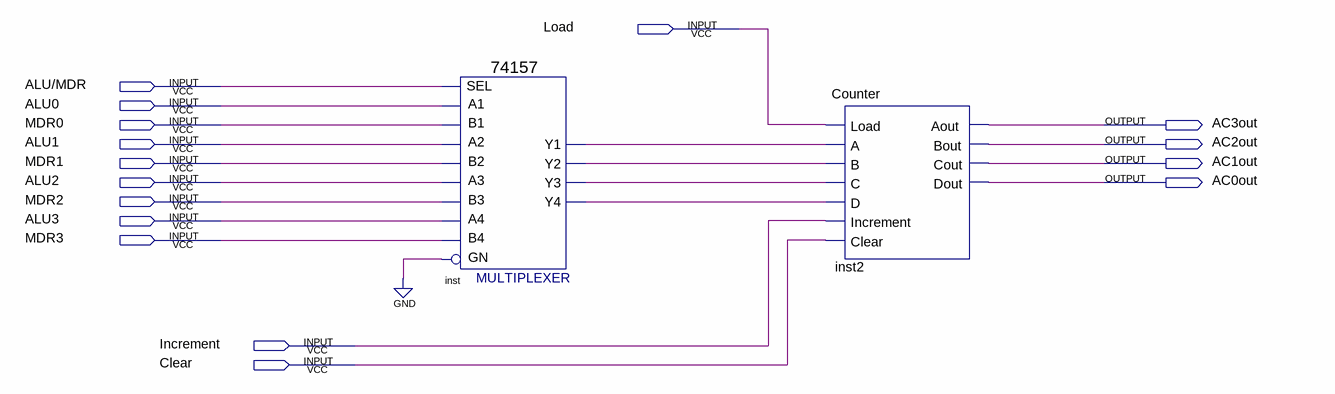
[diagram p0: schematic sheet]
// Quartus schematic Accumulater.bdf as structural Verilog: 2 symbols, 16 pins
module Accumulater (
  input  Load,
  input  \ALU/MDR ,
  input  ALU0,
  input  MDR0,
  input  ALU1,
  input  MDR1,
  input  ALU2,
  input  MDR2,
  input  ALU3,
  input  MDR3,
  input  Increment,
  input  Clear,
  output AC3out,
  output AC2out,
  output AC1out,
  output AC0out
);

  wire inst_y1, inst_y2, inst_y3, inst_y4;

  \74157  inst (
    .A1(ALU0), .B1(MDR0), .SEL(\ALU/MDR ), .B2(MDR1), .A3(ALU2), .B3(MDR2), .A2(ALU1), .B4(MDR3), .GN(1'b0),
    .A4(ALU3), .Y2(inst_y2), .Y1(inst_y1), .Y4(inst_y4), .Y3(inst_y3));
  Counter inst2 (
    .Load(Load), .A(inst_y1), .B(inst_y2), .C(inst_y3), .D(inst_y4), .Increment(Increment), .Clear(Clear),
    .Aout(AC3out), .Bout(AC2out), .Cout(AC1out), .Dout(AC0out));
endmodule
